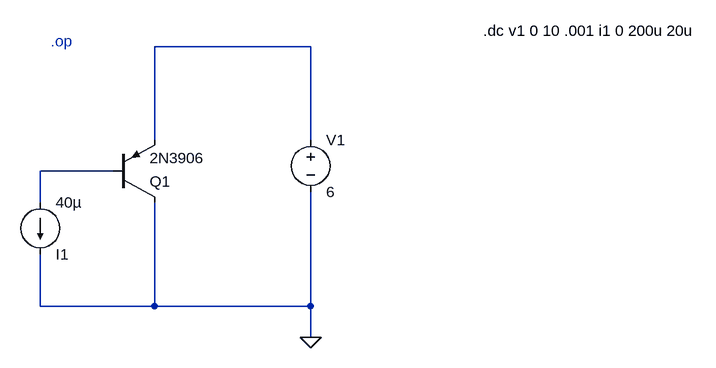
[diagram p0: schematic npn2n3906.asc]
npn2n3906.asc, the LTspice schematic file:
Version 4
SHEET 1 1392 984
WIRE -432 208 -672 208
WIRE -672 352 -672 208
WIRE -432 352 -432 208
WIRE -736 400 -848 400
WIRE -848 448 -848 400
WIRE -848 608 -848 528
WIRE -672 608 -672 448
WIRE -672 608 -848 608
WIRE -432 608 -432 432
WIRE -432 608 -672 608
WIRE -432 656 -432 608
FLAG -432 656 0
SYMBOL voltage -432 336 R0
WINDOW 123 0 0 Left 0
WINDOW 39 0 0 Left 0
SYMATTR InstName V1
SYMATTR Value 6
SYMBOL current -848 448 R0
WINDOW 0 24 80 Left 2
WINDOW 3 24 0 Left 2
WINDOW 123 0 0 Left 0
WINDOW 39 0 0 Left 0
SYMATTR InstName I1
SYMATTR Value 40µ
SYMBOL pnp -736 448 M180
SYMATTR InstName Q1
SYMATTR Value 2N3906
TEXT 160 184 Right 2 !.dc v1 0 10 .001 i1 0 200u 20u
TEXT -832 200 Left 2 ;.op

The netlist it stands for:
* npn2n3906.asc
V1 N001 0 6
I1 N002 0 40µ
Q1 0 N002 N001 0 2N3906
.model NPN NPN
.model PNP PNP
.lib standard.bjt
.dc v1 0 10 .001 i1 0 200u 20u
* .op
.backanno
.end